# EAGLE design TTLjig (EAGLE 6.6.0)
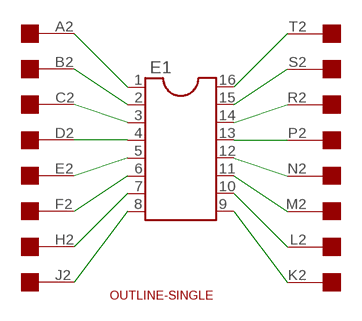
[diagram p0: schematic, sheet 1]

## Parts
E1  DIL16  [DIL16]
U$1  OUTLINE-SINGLE  [SINGLE]
U$2  EDGE-1  [EDGE-CON1]

## Nets
N$1: E1.8 U$2.J2
N$2: E1.1 U$2.A2
N$3: E1.13 U$2.P2
N$4: E1.7 U$2.H2
N$5: E1.6 U$2.F2
N$6: E1.5 U$2.E2
N$7: E1.4 U$2.D2
N$8: E1.3 U$2.C2
N$9: E1.2 U$2.B2
N$10: E1.16 U$2.T2
N$11: E1.15 U$2.S2
N$12: E1.14 U$2.R2
N$13: E1.9 U$2.K2
N$14: E1.10 U$2.L2
N$15: E1.11 U$2.M2
N$16: E1.12 U$2.N2
Unconnected: U$2.U2 U$2.V2

## Library data of the parts
E1 = ic-package:DIL16: Dual In Line / Socket
U$1 = dec-con:OUTLINE-*: Board outlines for DEC boards.
U$2 = dec-con:EDGE-1: Single-Sided DEC Edge Connector -- (side 2)

## Board
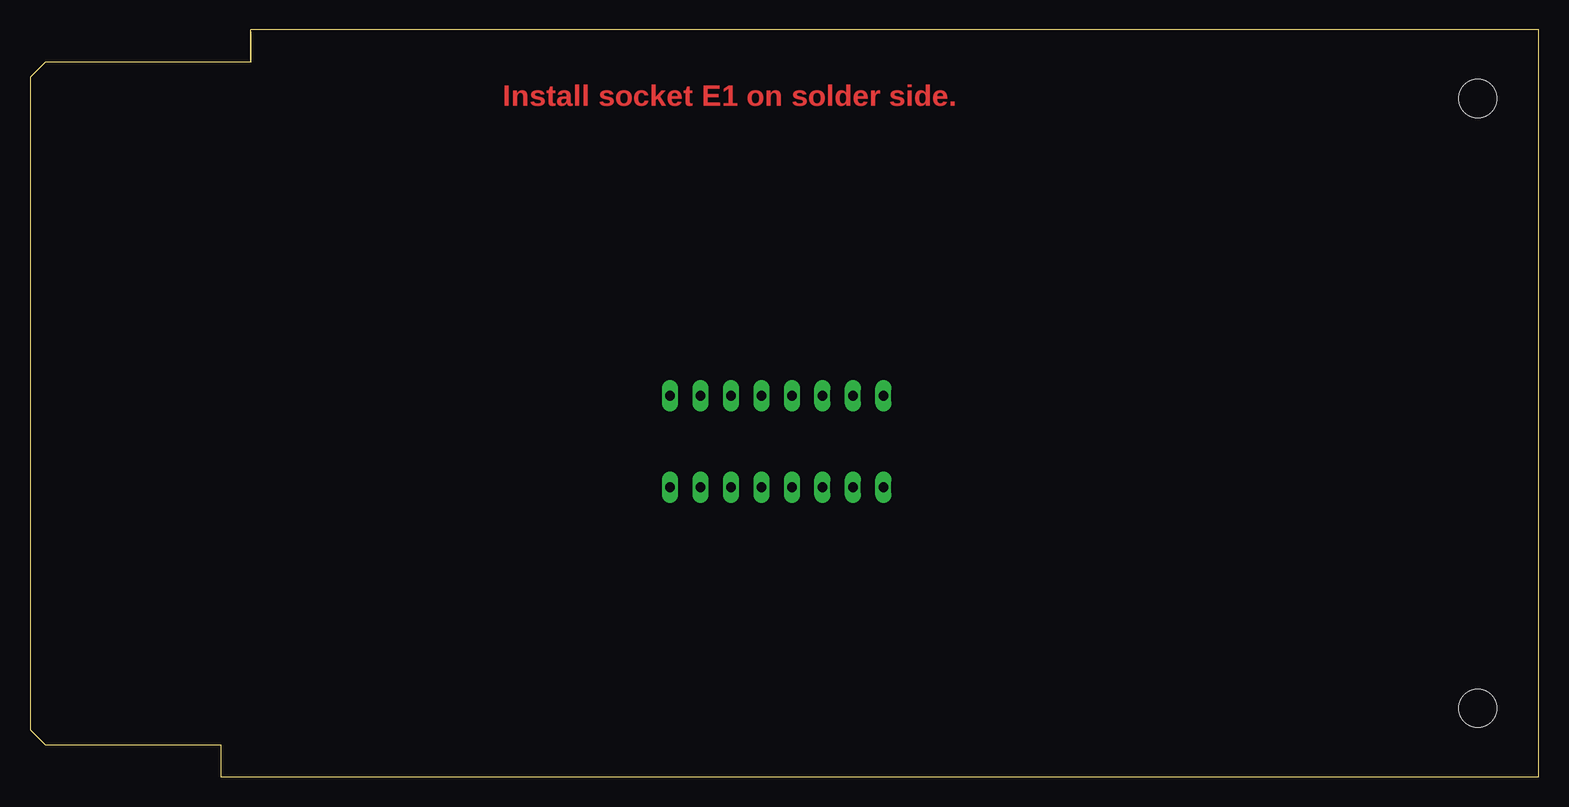
[diagram p1: board, top side]
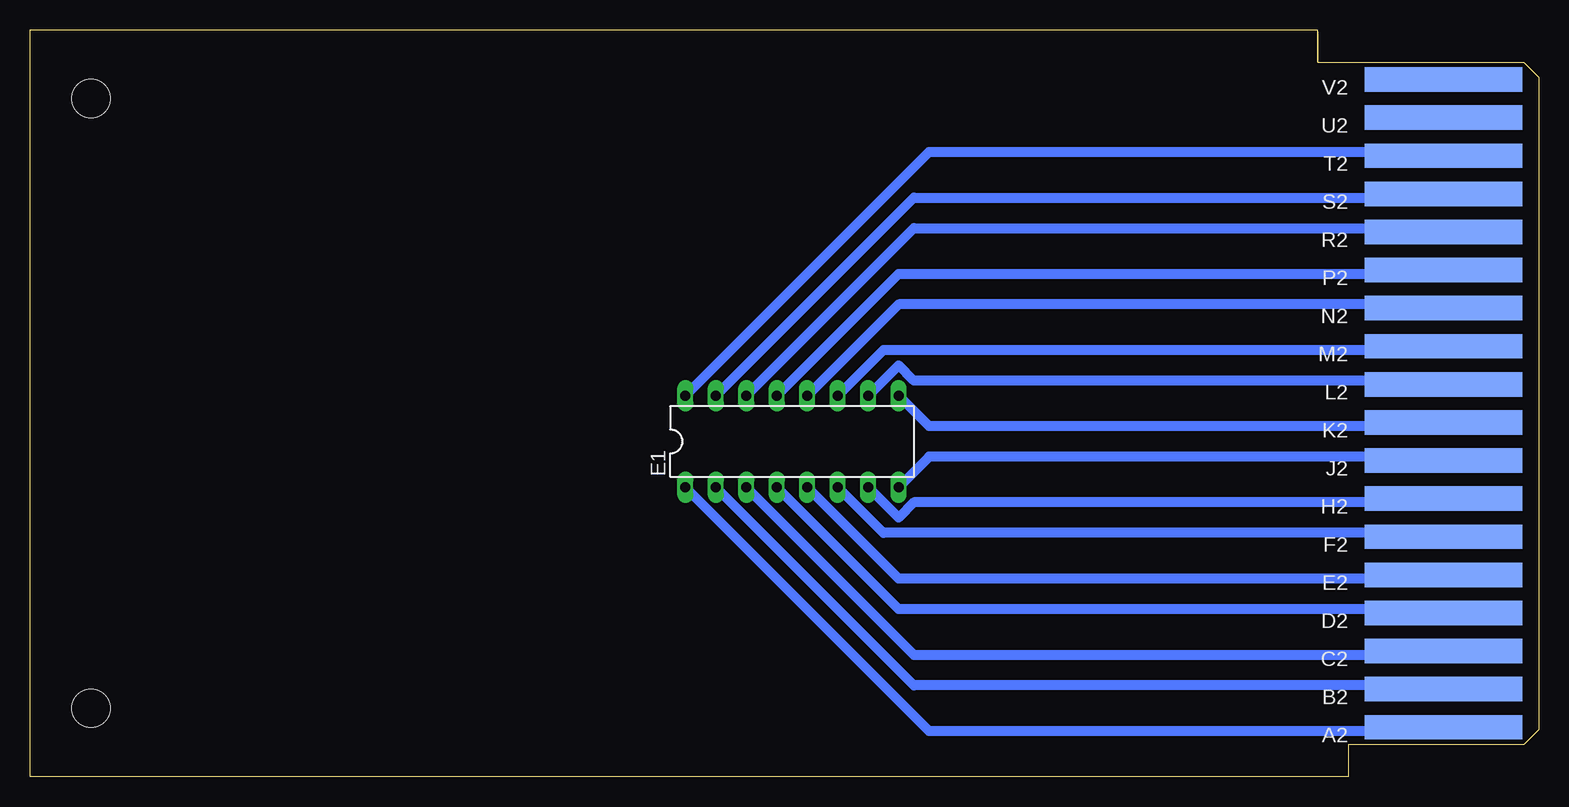
[diagram p2: board, bottom side, seen from below]

Size 125.73 x 62.23 mm. Coordinates in mm from the lower left corner, seen from the top.
Copper layers (1+16): Top 0.035mm / dielectric 1.5mm / Bottom 0.035mm
Design rules "16mils": minimum track width 16mil, minimum drill 32mil, track to track 15mil, track to pad 10mil, pad to pad 10mil, via to via 10mil, smd to smd 10mil, copper to edge 13mil, drill to drill 10mil, minimum pad ring 10mil, minimum via ring 8mil, stop-mask expansion 0mil, vias tented up to drill 0mil, thermal gap 10mil

### Footprints (pad centres in the part's own frame; a part is rotated, then mirrored left to right if it is on the bottom)
DIL16 = drill 0.813 long: 1 -8.89,-3.81; 2 -6.35,-3.81; 3 -3.81,-3.81; 4 -1.27,-3.81; 5 1.27,-3.81; 6 3.81,-3.81; 7 6.35,-3.81; 8 8.89,-3.81; 9 8.89,3.81; 10 6.35,3.81; 11 3.81,3.81; 12 1.27,3.81; 13 -1.27,3.81; 14 -3.81,3.81; 15 -6.35,3.81; 16 -8.89,3.81
SINGLE = hole 3.175: 120.65,56.515; 120.65,5.715
EDGE-CON1 = smd 13.106 x 2.032 bottom: A2 7.938,4.128; B2 7.938,7.303; C2 7.938,10.477; D2 7.938,13.652; E2 7.938,16.828; F2 7.938,20.003; H2 7.938,23.177; J2 7.938,26.352; K2 7.938,29.527; L2 7.938,32.703; M2 7.938,35.877; N2 7.938,39.053; P2 7.938,42.227; R2 7.938,45.403; S2 7.938,48.578; T2 7.938,51.752; U2 7.938,54.928; V2 7.938,58.102

### Placement (x,y rotation side)
E1  62.23,27.94 0 bottom
U$1  0,0 0 top
U$2  0,0 0 top

### Tracks (layer width: path | path; a pad name or v marks a point on that pad's centre or on a via)
N$1
  Bottom 0.813: U$2.J2 8.89,26.67 50.8,26.67 E1.8
N$2
  Bottom 0.813: E1.1 50.8,3.81 8.89,3.81 U$2.A2
N$3
  Bottom 0.813: E1.13 53.34,41.91 8.89,41.91 U$2.P2
N$4
  Bottom 0.813: E1.7 53.34,21.59 52.07,22.86 8.89,22.86 U$2.H2
N$5
  Bottom 0.813: U$2.F2 8.89,20.32 54.61,20.32 E1.6
N$6
  Bottom 0.813: E1.5 53.34,16.51 8.89,16.51 U$2.E2
N$7
  Bottom 0.813: E1.4 53.34,13.97 8.89,13.97 U$2.D2
N$8
  Bottom 0.813: E1.3 52.07,10.16 8.89,10.16 U$2.C2
N$9
  Bottom 0.813: E1.2 52.07,7.62 8.89,7.62 U$2.B2
N$10
  Bottom 0.813: E1.16 50.8,52.07 8.89,52.07 U$2.T2
N$11
  Bottom 0.813: E1.15 52.07,48.26 8.89,48.26 U$2.S2
N$12
  Bottom 0.813: E1.14 52.07,45.72 8.89,45.72 U$2.R2
N$13
  Bottom 0.813: U$2.K2 8.89,29.21 50.8,29.21 E1.9
N$14
  Bottom 0.813: U$2.L2 8.89,33.02 52.07,33.02 53.34,34.29 E1.10
N$15
  Bottom 0.813: U$2.M2 8.89,35.56 54.61,35.56 E1.11
N$16
  Bottom 0.813: E1.12 53.34,39.37 8.89,39.37 U$2.N2

### Text on the board
Top: Install socket E1 on solder side.